# Altium project egse.PrjPcb (part 4 of 5)

## Sheet 5_3_frontend.SchDoc: RF Front-end module
size A4; OrganizationName: Pluton UPV; Address1: Universitat Politècnica; Address2: de València (UPV); Address3: Camí de Vera, València; Address4: Spain; SheetNumber: 9; SheetTotal: 12
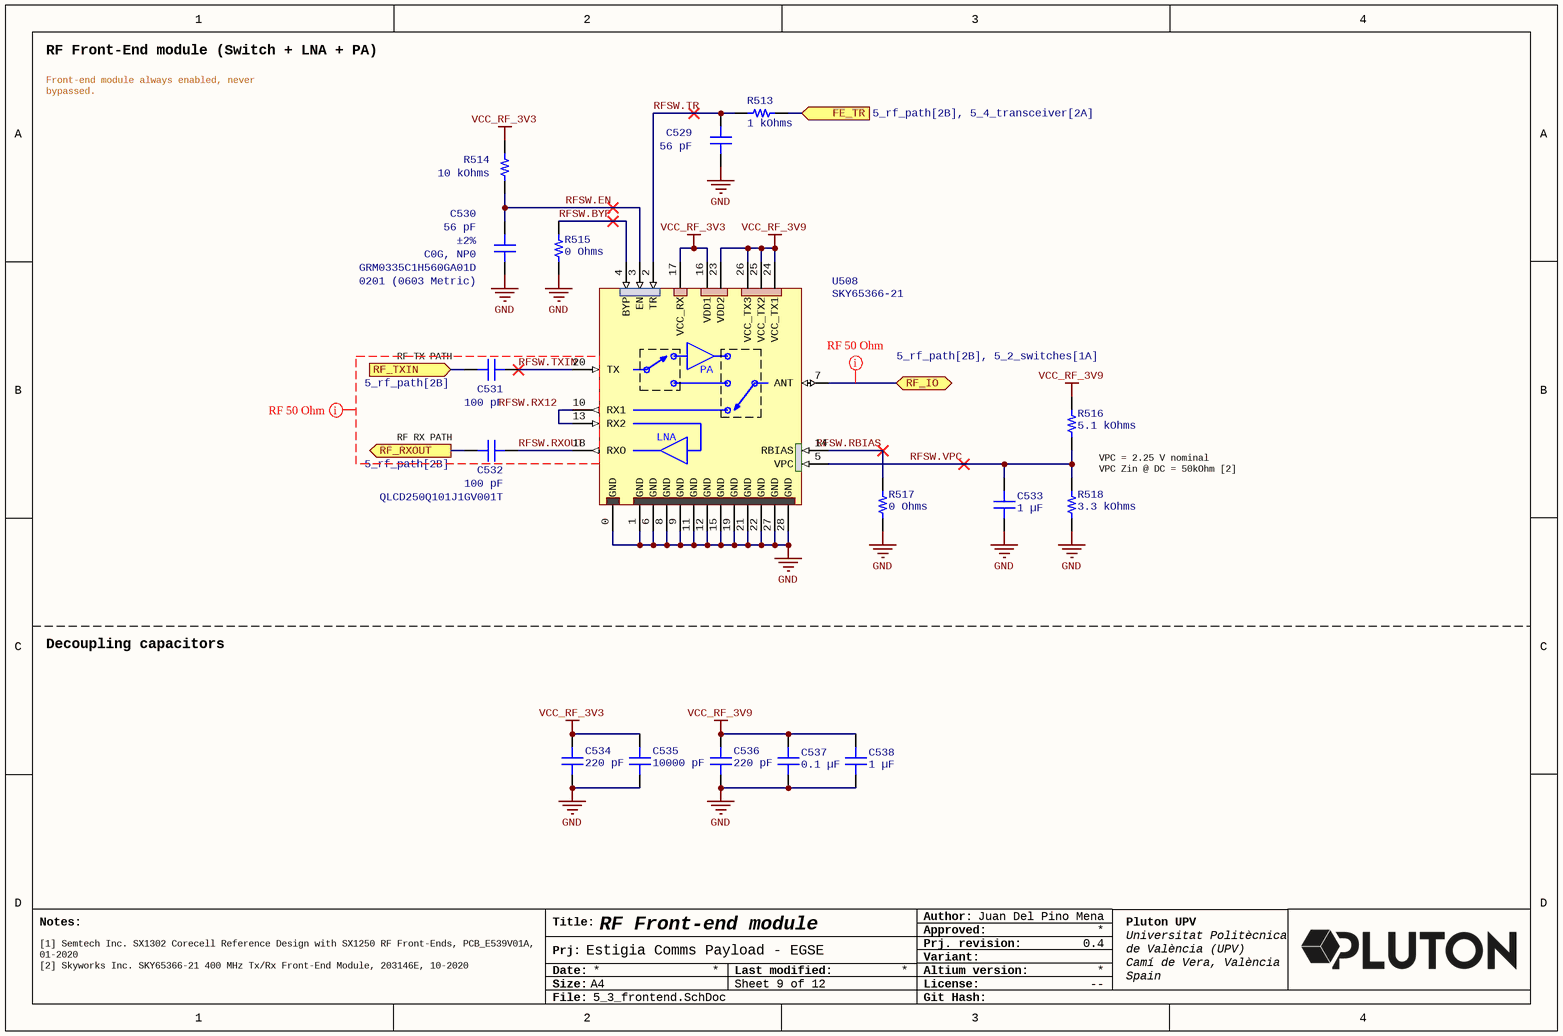
[diagram p7: 5_3_frontend.SchDoc]

### Parts
C529  56 pF  [CAP 0201_0603]
C530  Part Number: GRM0335C1H560GA01D  Package / Case: 0201 (0603 Metric)  Temperature Coefficient: C0G, NP0  Tolerance: ±2%  [CAP 0201_0603]  (hidden comment: 56 pF)
C531  Part Number: QLCD250Q101J1GV001T  [CAP 0201_0603 RF]  (hidden comment: 100 pF)
C532  100 pF  [CAP 0201_0603 RF]
C533  1 µF  [CAP 0402_1005]
C534  220 pF  [CAP 0201_0603]
C535  10000 pF  [CAP 0402_1005]
C536  220 pF  [CAP 0201_0603]
C537  0.1 µF  [CAP 0402_1005]
C538  1 µF  [CAP 0402_1005]
R513  1 kOhms  [RES 0201_0603]
R514  10 kOhms  [RES 0201_0603]
R515  0 Ohms  [RES 0201_0603]
R516  5.1 kOhms  [RES 0201_0603]
R517  0 Ohms  [RES 0201_0603]
R518  3.3 kOhms  [RES 0201_0603]
U508  SKY65366-21  [MCM-28-SKY65366-21]

### Ports
FE_TR (in, see 5_rf_path[2B], 5_4_transceiver[2A]), RF_IO (bidir, see 5_rf_path[2B], 5_2_switches[1A]), RF_RXOUT (out, see 5_rf_path[2B]), RF_TXIN (in, see 5_rf_path[2B])

### Nets
GND: C529.1 C530.1 C533.1 C534.1 C535.1 C536.1 C537.1 C538.1 R515.1 R517.1 R518.1 U508.0(GND) U508.1(GND) U508.6(GND) U508.8(GND) U508.9(GND) U508.11(GND) U508.12(GND) U508.15(GND) U508.19(GND) U508.21(GND) U508.22(GND) U508.27(GND) U508.28(GND)
VCC_RF_3V3: C534.2 C535.2 R514.2 U508.16(VDD1) U508.17(VCC_RX)
VCC_RF_3V9: C536.2 C537.2 C538.2 R516.2 U508.23(VDD2) U508.24(VCC_TX1) U508.25(VCC_TX2) U508.26(VCC_TX3)
FE_TR: R513.2 ; port FE_TR
RF_IO: U508.7(ANT) ; port RF_IO
RF_RXIN: C532.1 ; port RF_RXOUT
RF_TXIN: C531.1 ; port RF_TXIN
RFSW.BYP: R515.2 U508.4(BYP)  [project net RFSW.BYP_9]
RFSW.EN: C530.2 R514.1 U508.3(EN)  [project net RFSW.EN_9]
RFSW.RBIAS: R517.2 U508.14(RBIAS)  [project net RFSW.RBIAS_9]
RFSW.RX12: U508.10(RX1) U508.13(RX2)  [project net RFSW.RX12_9]
RFSW.RXOUT: C532.2 U508.18(RXO)  [project net RFSW.RXOUT_9]
RFSW.TR: C529.2 R513.1 U508.2(TR)  [project net RFSW.TR_9]
RFSW.TXIN: C531.2 U508.20(TX)  [project net RFSW.TXIN_9]
RFSW.VPC: C533.2 R516.1 R518.2 U508.5(VPC)  [project net RFSW.VPC_9]

### Layout directives
net class RF50; rule Width Constraint [Pref Impedance = 50.00ohms    Min Impedance = 50.00ohms    Max Impedance = 50.00ohms]: RF_IO, RFSW.RX12, RFSW.RXOUT, RFSW.TXIN

### Notes on the sheet
- Front-end module always enabled, never bypassed.
- RF Front-End module (Switch + LNA + PA)
- (near C531) RF TX PATH
- (near C532) RF RX PATH
- VPC = 2.25 V nominal
  VPC Zin @ DC = 50kOhm [2]
- Decoupling capacitors
- [1] Semtech Inc. SX1302 Corecell Reference Design with SX1250 RF Front-Ends, PCB_E539V01A, 01-2020
  [2] Skyworks Inc. SKY65366-21 400 MHz Tx/Rx Front-End Module, 203146E, 10-2020
- Notes:
- Title:
- Author:
- Approved:
- Date:
- Prj:
- Size:
- A4
- Last modified:
- Altium version:
- Variant:
- Prj. revision:
- License:
- --
- File:
- Git Hash:
- (in symbol SKY65366-21) PA; LNA

### Library data of the parts
C529 = GRM0335C1H560GA01D: CAP CER 56PF 50V C0G/NP0 0201; manufacturer: Murata Electronics; Temperature Coefficient: C0G, NP0; Tolerance: ±2%; Part Number: GRM0335C1H560GA01D; Value: 56 pF; Applications: General Purpose; Capacitance: 56 pF; componentlink1description: Datasheet; componentlink1url: https://search.murata.co.jp/Ceramy/image/img/A01X/G101/ENG/GRM0335C1H560GA01-01.pdf; componentlink2description: DigiKey Link; componentlink2url: https://www.digikey.com/en/products/detail/murata-electronics/GRM0335C1H560GA01D/4358755; Device Package: 0201 (0603 Metric); lastupdated: 04/06/2024 19:01:09; Lifecycle Status: Active; Minimum Order: 1; Mounting Type: Surface Mount; Operating Temperature: -55°C ~ 125°C; Package / Case: 0201 (0603 Metric); packaging: CutTape; partid: 528; Part Status: Active; price: 0.01; series: GRM; Size / Dimension: 0.024" L x 0.012" W (0.60mm x 0.30mm); Supplier 1: DigiKey; Supplier Part Number 1: 490-13329-1-ND; Thickness (Max): 0.013" (0.33mm); Voltage - Rated: 50V
C530 = GRM0335C1H560GA01D: CAP CER 56PF 50V C0G/NP0 0201; manufacturer: Murata Electronics; Value: 56 pF; Applications: General Purpose; Capacitance: 56 pF; componentlink1description: Datasheet; componentlink1url: https://search.murata.co.jp/Ceramy/image/img/A01X/G101/ENG/GRM0335C1H560GA01-01.pdf; componentlink2description: DigiKey Link; componentlink2url: https://www.digikey.com/en/products/detail/murata-electronics/GRM0335C1H560GA01D/4358755; Device Package: 0201 (0603 Metric); lastupdated: 04/06/2024 19:01:09; Lifecycle Status: Active; Minimum Order: 1; Mounting Type: Surface Mount; Operating Temperature: -55°C ~ 125°C; packaging: CutTape; partid: 528; Part Status: Active; price: 0.01; series: GRM; Size / Dimension: 0.024" L x 0.012" W (0.60mm x 0.30mm); Supplier 1: DigiKey; Supplier Part Number 1: 490-13329-1-ND; Thickness (Max): 0.013" (0.33mm); Voltage - Rated: 50V
C531 C532 = QLCD250Q101J1GV001T: CAP CER 100PF 25V C0G/NP0 0201; manufacturer: Johanson Technology Inc.; Temperature Coefficient: C0G, NP0; Tolerance: ±5%; Applications: RF, Microwave, High Frequency; Capacitance: 100 pF; componentlink1description: Datasheet; componentlink1url: https://www.johansontechnology.com/downloads/catalog/johanson-technology-multi-layer-high-q-capacitors.pdf; componentlink2description: DigiKey Link; componentlink2url: https://www.digikey.com/en/products/detail/johanson-technology-inc/QLCD250Q101J1GV001T/1561511; Device Package: 0201 (0603 Metric); Features: High Q, Low Loss; lastupdated: 03/06/2024 19:34:07; Lifecycle Status: Active; Minimum Order: 1; Mounting Type: Surface Mount, MLCC; Operating Temperature: -55°C ~ 125°C; Package / Case: 0201 (0603 Metric); packaging: TapeAndReel; partid: 3724; Part Status: Active; price: 0.02; series: L; Size / Dimension: 0.024" L x 0.012" W (0.60mm x 0.30mm); Supplier 1: DigiKey; Supplier Part Number 1: 712-QLCD250Q101J1GV001TCT-ND; Thickness (Max): 0.013" (0.33mm); value: 100 pF; Voltage - Rated: 25V
  C532: Part Number: QLCD250Q101J1GV001T
C533 = CL05A105KO5NNNC: CAP CER 1UF 16V X5R 0402; manufacturer: Samsung Electro-Mechanics; Tolerance: ±10%; Part Number: CL05A105KO5NNNC; Value: 1 µF; Applications: General Purpose; Capacitance: 1 µF; componentlink1description: Datasheet; componentlink1url: http://www.samsungsem.com/kr/support/product-search/mlcc/CL05A105KO5NNNC.jsp; componentlink2description: DigiKey Link; componentlink2url: https://www.digikey.com/en/products/detail/samsung-electro-mechanics/CL05A105KO5NNNC/3886725; Device Package: 0402 (1005 Metric); lastupdated: 09/02/2024 20:04:35; Lifecycle Status: Active; Minimum Order: 1; Mounting Type: Surface Mount, MLCC; Operating Temperature: -55°C ~ 85°C; Package / Case: 0402 (1005 Metric); packaging: TapeAndReel; partid: 3120; Part Status: Active; price: 0.01; series: CL; Size / Dimension: 0.039" L x 0.020" W (1.00mm x 0.50mm); Supplier 1: DigiKey; Supplier Part Number 1: 1276-1067-1-ND; Temperature Coefficient: X5R; Thickness (Max): 0.022" (0.55mm); Voltage - Rated: 16V
C534 C536 = GRM0335C1H221JA01D: CAP CER 220PF 50V C0G/NP0 0201; manufacturer: Murata Electronics; Temperature Coefficient: C0G, NP0; Tolerance: ±5%; Part Number: GRM0335C1H221JA01D; Value: 220 pF; Applications: General Purpose; Capacitance: 220 pF; componentlink1description: Datasheet; componentlink1url: https://search.murata.co.jp/Ceramy/image/img/A01X/G101/ENG/GRM0335C1H221JA01-01.pdf; componentlink2description: DigiKey Link; componentlink2url: https://www.digikey.com/en/products/detail/murata-electronics/GRM0335C1H221JA01D/4904370; Device Package: 0201 (0603 Metric); lastupdated: 04/06/2024 19:01:09; Lifecycle Status: Active; Minimum Order: 1; Mounting Type: Surface Mount; Operating Temperature: -55°C ~ 125°C; Package / Case: 0201 (0603 Metric); packaging: CutTape; partid: 574; Part Status: Active; price: 0.01; series: GRM; Size / Dimension: 0.024" L x 0.012" W (0.60mm x 0.30mm); Supplier 1: DigiKey; Supplier Part Number 1: 490-11316-1-ND; Thickness (Max): 0.013" (0.33mm); Voltage - Rated: 50V
C535 = GRM1555C1E103JE01J: CAP CER 10000PF 25V C0G/NP0 0402; manufacturer: Murata Electronics; Temperature Coefficient: C0G, NP0; Tolerance: ±5%; Part Number: GRM1555C1E103JE01J; Value: 10000 pF; Applications: General Purpose; Capacitance: 10000 pF; componentlink1description: Datasheet; componentlink1url: https://search.murata.co.jp/Ceramy/image/img/A01X/G101/ENG/GRM1555C1E103JE01-01A.pdf; componentlink2description: DigiKey Link; componentlink2url: https://www.digikey.com/en/products/detail/murata-electronics/GRM1555C1E103JE01J/16033801; Device Package: 0402 (1005 Metric); lastupdated: 09/02/2024 20:04:09; Lifecycle Status: Active; Minimum Order: 1; Mounting Type: Surface Mount, MLCC; Operating Temperature: -55°C ~ 125°C; Package / Case: 0402 (1005 Metric); packaging: TapeAndReel; partid: 41084; Part Status: Active; price: 0.02; series: GRM; Size / Dimension: 0.039" L x 0.020" W (1.00mm x 0.50mm); Supplier 1: DigiKey; Supplier Part Number 1: 490-GRM1555C1E103JE01JCT-ND; Thickness (Max): 0.026" (0.65mm); Voltage - Rated: 25V
C537 = C0402C104K4RECAUTO: CAP CER 0402 0.1UF 16V X7R 10%; manufacturer: KEMET; Part Number: C0402C104K4RECAUTO; Value: 0.1 µF; Applications: Automotive, ESD Protection; Capacitance: 0.1 µF; componentlink1description: Datasheet; componentlink1url: https://api.kemet.com/component-edge/download/datasheet/C0402C104K4RECAUTO.pdf; componentlink2description: DigiKey Link; componentlink2url: https://www.digikey.com/en/products/detail/kemet/C0402C104K4RECAUTO/8563695; Device Package: 0402 (1005 Metric); lastupdated: 09/02/2024 20:04:38; Lifecycle Status: Active; Minimum Order: 1; Mounting Type: Surface Mount, MLCC; Operating Temperature: -55°C ~ 125°C; Package / Case: 0402 (1005 Metric); packaging: TapeAndReel; partid: 1731; Part Status: Active; price: 0.01; Ratings: AEC-Q200; series: ESD SMD Auto X7R; Size / Dimension: 0.039" L x 0.020" W (1.00mm x 0.50mm); Supplier 1: DigiKey; Supplier Part Number 1: 399-17167-1-ND; Temperature Coefficient: X7R; Thickness (Max): 0.022" (0.55mm); Tolerance: ±10%; Voltage - Rated: 16V
C538 = GRT155C71A105KE13D: CAP CER 1UF 10V X7S 0402; manufacturer: Murata Electronics; Tolerance: ±10%; Part Number: GRT155C71A105KE13D; Value: 1 µF; Applications: Automotive; Capacitance: 1 µF; componentlink1description: Datasheet; componentlink1url: https://search.murata.co.jp/Ceramy/image/img/A01X/G101/ENG/GRT155C71A105KE13-01.pdf; componentlink2description: DigiKey Link; componentlink2url: https://www.digikey.com/en/products/detail/murata-electronics/GRT155C71A105KE13D/10695747; Device Package: 0402 (1005 Metric); lastupdated: 09/02/2024 20:04:05; Lifecycle Status: Active; Minimum Order: 1; Mounting Type: Surface Mount, MLCC; Operating Temperature: -55°C ~ 125°C; Package / Case: 0402 (1005 Metric); packaging: TapeAndReel; partid: 47127; Part Status: Active; price: 0.04; Ratings: AEC-Q200; series: GRT; Size / Dimension: 0.039" L x 0.020" W (1.00mm x 0.50mm); Supplier 1: DigiKey; Supplier Part Number 1: 490-GRT155C71A105KE13DCT-ND; Temperature Coefficient: X7S; Thickness (Max): 0.024" (0.60mm); Voltage - Rated: 10V
R513 = AC0201FR-071KL: RES SMD 1K OHM 1% 1/20W 0201; Manufacturer: Yageo; Power (Watts): 0.05W, 1/20W; Temperature Coefficient: ±200ppm/°C; Part Number: AC0201FR-071KL; Value: 1 kOhms; ComponentLink1Description: Datasheet; ComponentLink1URL: https://www.yageo.com/upload/media/product/productsearch/datasheet/rchip/PYu-AC_51_RoHS_L_7.pdf; ComponentLink2Description: DigiKey Link; ComponentLink2URL: https://www.digikey.com/en/products/detail/yageo/AC0201FR-071KL/5894376; Composition: Thick Film; Device Package: 0201 (0603 Metric); Features: Automotive AEC-Q200, Moisture Resistant; Height - Seated (Max): 0.010" (0.26mm); LastUpdated: 04/06/2024 19:11:52; Lifecycle Status: Active; Minimum Order: 1; Number of Terminations: 2; Operating Temperature: -55°C ~ 155°C; Package / Case: 0201 (0603 Metric); Packaging: TapeAndReel; PartId: 4299; Part Status: Active; Price: 0.01; Ratings: AEC-Q200; Resistance: 1 kOhms; Series: AC; Size / Dimension: 0.024" L x 0.012" W (0.60mm x 0.30mm); Supplier 1: DigiKey; Supplier Part Number 1: YAG3417CT-ND; Supplier Device Package: 0201; Tolerance: ±1%
R514 = AF0201FR-0710KL: RES SMD 10K OHM 1% 1/20W 0201; Manufacturer: Yageo; Power (Watts): 0.05W, 1/20W; Temperature Coefficient: ±200ppm/°C; Part Number: AF0201FR-0710KL; Value: 10 kOhms; ComponentLink1Description: Datasheet; ComponentLink1URL: https://www.yageo.com/upload/media/product/productsearch/datasheet/rchip/PYu-AF_51_RoHS_L_9.pdf; ComponentLink2Description: DigiKey Link; ComponentLink2URL: https://www.digikey.com/en/products/detail/yageo/AF0201FR-0710KL/5900138; Composition: Thick Film; Device Package: 0201 (0603 Metric); Features: Anti-Sulfur, Automotive AEC-Q200; Height - Seated (Max): 0.010" (0.26mm); LastUpdated: 04/06/2024 19:11:47; Lifecycle Status: Active; Minimum Order: 1; Number of Terminations: 2; Operating Temperature: -55°C ~ 125°C; Package / Case: 0201 (0603 Metric); Packaging: TapeAndReel; PartId: 78061; Part Status: Active; Price: 0.01; Ratings: AEC-Q200; Resistance: 10 kOhms; Series: AF; Size / Dimension: 0.024" L x 0.012" W (0.60mm x 0.30mm); Supplier 1: DigiKey; Supplier Part Number 1: 13-AF0201FR-0710KLCT-ND; Supplier Device Package: 0201; Tolerance: ±1%
R515 R517 = AC0201JR-070RL: RES SMD 0 OHM JUMPER 1/20W 0201; Manufacturer: Yageo; Power (Watts): 0.05W, 1/20W; Part Number: AC0201JR-070RL; Value: 0 Ohms; ComponentLink1Description: Datasheet; ComponentLink1URL: https://www.yageo.com/upload/media/product/productsearch/datasheet/rchip/PYu-AC_51_RoHS_L_7.pdf; ComponentLink2Description: DigiKey Link; ComponentLink2URL: https://www.digikey.com/en/products/detail/yageo/AC0201JR-070RL/5894880; Composition: Thick Film; Device Package: 0201 (0603 Metric); Features: Automotive AEC-Q200, Moisture Resistant; Height - Seated (Max): 0.010" (0.26mm); LastUpdated: 04/06/2024 19:12:00; Lifecycle Status: Active; Minimum Order: 1; Number of Terminations: 2; Operating Temperature: -55°C ~ 155°C; Package / Case: 0201 (0603 Metric); Packaging: CutTape; PartId: 818; Part Status: Active; Price: 0.01; Ratings: AEC-Q200; Resistance: 0 Ohms; Series: AC; Size / Dimension: 0.024" L x 0.012" W (0.60mm x 0.30mm); Supplier 1: DigiKey; Supplier Part Number 1: YAG3427CT-ND; Supplier Device Package: 0201; Tolerance: Jumper
R516 = ERJ-1GNF5101C: RES SMD 5.1K OHM 1% 1/20W 0201; Manufacturer: Panasonic Electronic Components; Power (Watts): 0.05W, 1/20W; Temperature Coefficient: ±200ppm/°C; Part Number: ERJ-1GNF5101C; Value: 5.1 kOhms; ComponentLink1Description: Datasheet; ComponentLink1URL: https://industrial.panasonic.com/cdbs/www-data/pdf/RDA0000/AOA0000C304.pdf; ComponentLink2Description: DigiKey Link; ComponentLink2URL: https://www.digikey.com/en/products/detail/panasonic-electronic-components/ERJ-1GNF5101C/2036192; Composition: Thick Film; Device Package: 0201 (0603 Metric); Features: Automotive AEC-Q200; Height - Seated (Max): 0.010" (0.26mm); LastUpdated: 04/06/2024 19:11:52; Lifecycle Status: Active; Minimum Order: 1; Number of Terminations: 2; Operating Temperature: -55°C ~ 125°C; Package / Case: 0201 (0603 Metric); Packaging: TapeAndReel; PartId: 4177; Part Status: Active; Price: 0.01; Ratings: AEC-Q200; Resistance: 5.1 kOhms; Series: ERJ-1GN; Size / Dimension: 0.024" L x 0.012" W (0.60mm x 0.30mm); Supplier 1: DigiKey; Supplier Part Number 1: P123051CT-ND; Supplier Device Package: 0201; Tolerance: ±1%
R518 = ERJ-1GJF3301C: RES SMD 3.3K OHM 1% 1/20W 0201; Manufacturer: Panasonic Electronic Components; Power (Watts): 0.05W, 1/20W; Temperature Coefficient: ±200ppm/°C; Part Number: ERJ-1GJF3301C; Value: 3.3 kOhms; ComponentLink1Description: Datasheet; ComponentLink1URL: https://api.pim.na.industrial.panasonic.com/file_stream/main/fileversion/1263; ComponentLink2Description: DigiKey Link; ComponentLink2URL: https://www.digikey.com/en/products/detail/panasonic-electronic-components/ERJ-1GJF3301C/19101344; Composition: Thick Film; Device Package: 0201 (0603 Metric); Features: Automotive AEC-Q200; Height - Seated (Max): 0.010" (0.26mm); LastUpdated: 04/06/2024 19:11:47; Lifecycle Status: Active; Minimum Order: 1; Number of Terminations: 2; Operating Temperature: -55°C ~ 125°C; Package / Case: 0201 (0603 Metric); Packaging: TapeAndReel; PartId: 80200; Price: 0.02; Ratings: AEC-Q200; Resistance: 3.3 kOhms; Series: ERJ-1GJ; Size / Dimension: 0.024" L x 0.012" W (0.60mm x 0.30mm); Supplier 1: DigiKey; Supplier Part Number 1: 10-ERJ-1GJF3301CCT-ND; Supplier Device Package: 0201; Tolerance: ±1%
U508 = SKY65366-21: 400 MHz Transmit/Receive Front-End Module

## Sheet 5_1_attenuators.SchDoc: RF Attenuators
size A4; OrganizationName: Pluton UPV; Address1: Universitat Politècnica; Address2: de València (UPV); Address3: Camí de Vera, València; Address4: Spain; SheetNumber: 7; SheetTotal: 12
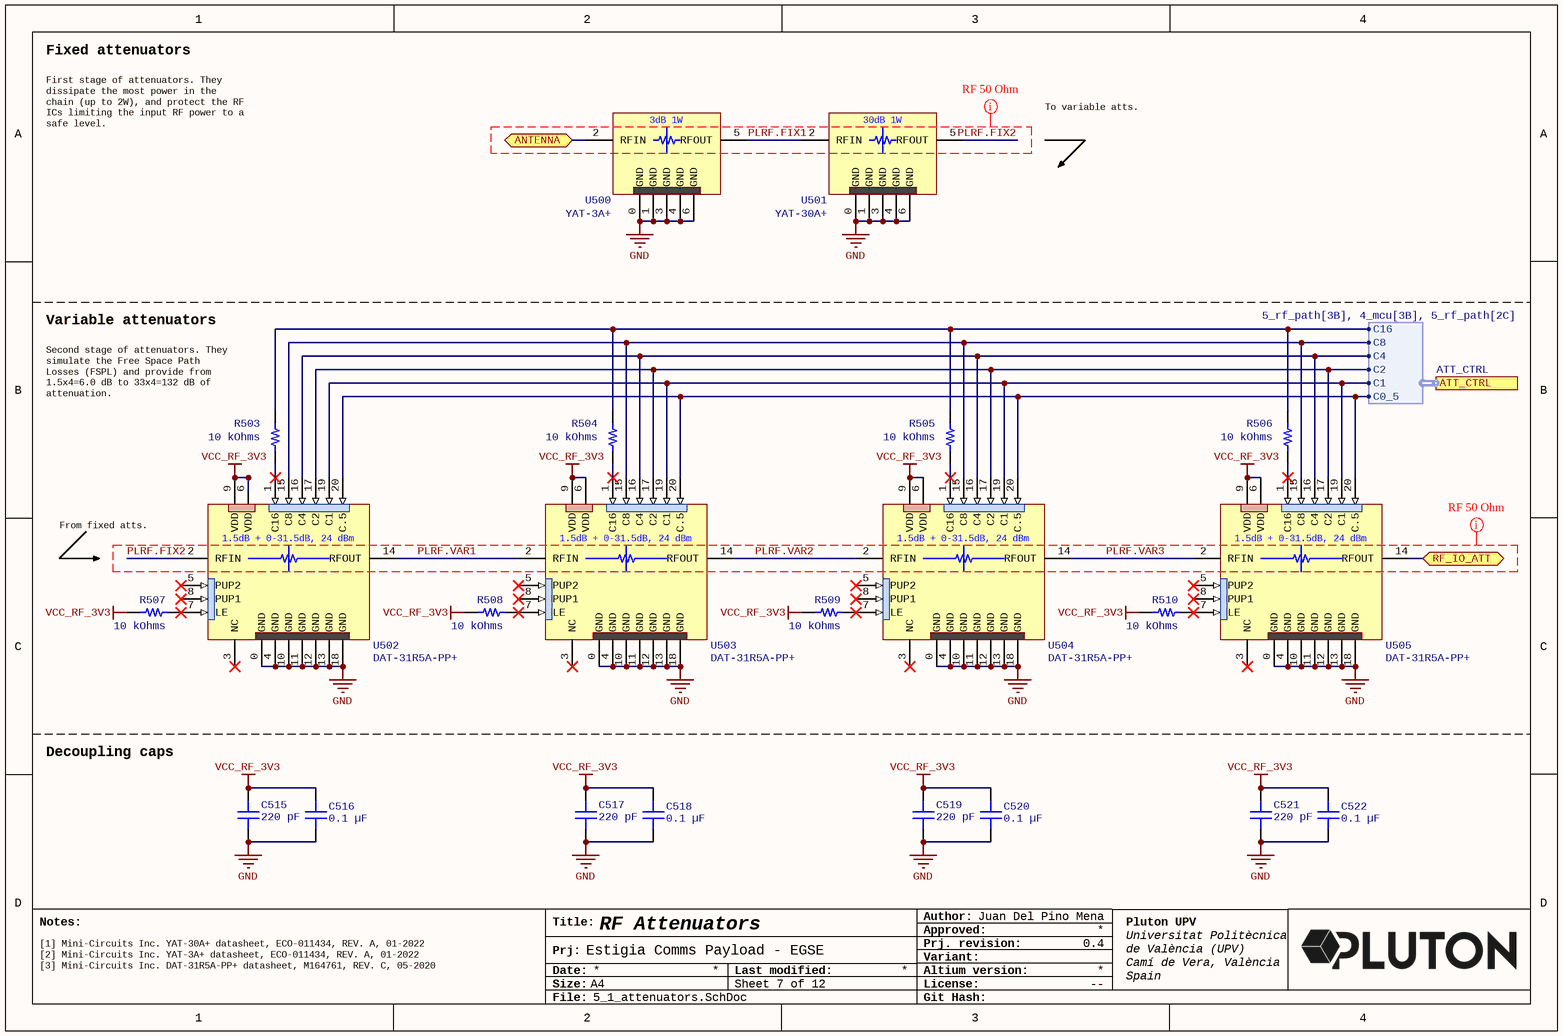
[diagram p8: 5_1_attenuators.SchDoc]

### Parts
C515  220 pF  [CAP 0201_0603]
C516  0.1 µF  [CAP 0402_1005]
C517  220 pF  [CAP 0201_0603]
C518  0.1 µF  [CAP 0402_1005]
C519  220 pF  [CAP 0201_0603]
C520  0.1 µF  [CAP 0402_1005]
C521  220 pF  [CAP 0201_0603]
C522  0.1 µF  [CAP 0402_1005]
R503  10 kOhms  [RES 0201_0603]
R504  10 kOhms  [RES 0201_0603]
R505  10 kOhms  [RES 0201_0603]
R506  10 kOhms  [RES 0201_0603]
R507  10 kOhms  [RES 0201_0603]
R508  10 kOhms  [RES 0201_0603]
R509  10 kOhms  [RES 0201_0603]
R510  10 kOhms  [RES 0201_0603]
U500  YAT-3A+  [MC1630]
U501  YAT-30A+  [MC1630]
U502  DAT-31R5A-PP+  [DG983-2]
U503  DAT-31R5A-PP+  [DG983-2]
U504  DAT-31R5A-PP+  [DG983-2]
U505  DAT-31R5A-PP+  [DG983-2]

### Ports
ANTENNA (bidir, see 5_rf_path[3B]), ATT_CTRL (harness ATT_CTRL, see 5_rf_path[3B], 4_mcu[3B], 5_rf_path[2C]), RF_IO_ATT (bidir, see 5_rf_path[3B], 5_2_switches[3B])

### Harnesses
ATT_CTRL: C16, C8, C4, C2, C1, C0_5

### Nets
GND: C515.1 C516.1 C517.1 C518.1 C519.1 C520.1 C521.1 C522.1 U500.0(GND) U500.1(GND) U500.3(GND) U500.4(GND) U500.6(GND) U501.0(GND) U501.1(GND) U501.3(GND) U501.4(GND) U501.6(GND) U502.0(GND) U502.4(GND) U502.10(GND) U502.11(GND) U502.12(GND) U502.13(GND) U502.18(GND) U503.0(GND) U503.4(GND) U503.10(GND) U503.11(GND) U503.12(GND) U503.13(GND) U503.18(GND) U504.0(GND) U504.4(GND) U504.10(GND) U504.11(GND) U504.12(GND) U504.13(GND) U504.18(GND) U505.0(GND) U505.4(GND) U505.10(GND) U505.11(GND) U505.12(GND) U505.13(GND) U505.18(GND)
VCC_RF_3V3: C515.2 C516.2 C517.2 C518.2 C519.2 C520.2 C521.2 C522.2 R507.2 R508.2 R509.2 R510.2 U502.6(VDD) U502.9(VDD) U503.6(VDD) U503.9(VDD) U504.6(VDD) U504.9(VDD) U505.6(VDD) U505.9(VDD)
ANTENNA: U500.2(RFIN) ; port ANTENNA
ATT_CTRL.C0_5: U502.20(C.5) U503.20(C.5) U504.20(C.5) U505.20(C.5) ; port ATT_CTRL.C0_5
ATT_CTRL.C1: U502.19(C1) U503.19(C1) U504.19(C1) U505.19(C1) ; port ATT_CTRL.C1
ATT_CTRL.C2: U502.17(C2) U503.17(C2) U504.17(C2) U505.17(C2) ; port ATT_CTRL.C2
ATT_CTRL.C4: U502.16(C4) U503.16(C4) U504.16(C4) U505.16(C4) ; port ATT_CTRL.C4
ATT_CTRL.C8: U502.15(C8) U503.15(C8) U504.15(C8) U505.15(C8) ; port ATT_CTRL.C8
ATT_CTRL.C16: R503.1 R504.1 R505.1 R506.1 ; port ATT_CTRL.C16
PLRF.FIX1: U500.5(RFOUT) U501.2(RFIN)  [project net PLRF.FIX1_7]
PLRF.FIX2: U501.5(RFOUT) U502.2(RFIN)  [project net PLRF.FIX2_7]
PLRF.VAR1: U502.14(RFOUT) U503.2(RFIN)  [project net PLRF.VAR1_7]
PLRF.VAR2: U503.14(RFOUT) U504.2(RFIN)  [project net PLRF.VAR2_7]
PLRF.VAR3: U504.14(RFOUT) U505.2(RFIN)  [project net PLRF.VAR3_7]
RF_IO_ATT: U505.14(RFOUT) ; port RF_IO_ATT
NetR503_2: R503.2 U502.1(C16)
NetR504_2: R504.2 U503.1(C16)
NetR505_2: R505.2 U504.1(C16)
NetR506_2: R506.2 U505.1(C16)
NetR507_1: R507.1 U502.7(LE)
NetR508_1: R508.1 U503.7(LE)
NetR509_1: R509.1 U504.7(LE)
NetR510_1: R510.1 U505.7(LE)

Not connected (* = marked no-connect by the designer): U502 3(NC)* 5(PUP2)* 8(PUP1)*; U503 3(NC)* 5(PUP2)* 8(PUP1)*; U504 3(NC)* 5(PUP2)* 8(PUP1)*; U505 3(NC)* 5(PUP2)* 8(PUP1)*

### Layout directives
net class RF50; rule Width Constraint [Pref Impedance = 50.00ohms    Min Impedance = 50.00ohms    Max Impedance = 50.00ohms]: PLRF.FIX1, PLRF.FIX2, PLRF.VAR1, PLRF.VAR2, PLRF.VAR3

### Notes on the sheet
- Fixed attenuators
- To variable atts.
- First stage of attenuators. They dissipate the most power in the chain (up to 2W), and protect the RF ICs limiting the input RF power to a safe level.
- Variable attenuators
- (near R503) Second stage of attenuators. They simulate the Free Space Path Losses (FSPL) and provide from 1.5x4=6.0 dB to 33x4=132 dB of attenuation.
- (near U502) From fixed atts.
- Decoupling caps
- [1] Mini-Circuits Inc. YAT-30A+ datasheet, ECO-011434, REV. A, 01-2022
  [2] Mini-Circuits Inc. YAT-3A+ datasheet, ECO-011434, REV. A, 01-2022
  [3] Mini-Circuits Inc. DAT-31R5A-PP+ datasheet, M164761, REV. C, 05-2020
- Notes:
- Title:
- Author:
- Approved:
- Date:
- Prj:
- Size:
- A4
- Last modified:
- Altium version:
- Variant:
- Prj. revision:
- License:
- --
- File:
- Git Hash:
- (in symbol DAT-31R5A-PP+) 1.5dB + 0-31.5dB, 24 dBm
- (in symbol YAT-3A) 3dB 1W
- (in symbol YAT-30A) 30dB 1W

### Library data of the parts
C515 C517 C519 C521 = GRM0335C1H221JA01D: as C534 on sheet 5_3_frontend; Part Number: GRM0335C1H221JA01D; Value: 220 pF; Applications: General Purpose; Capacitance: 220 pF; componentlink1description: Datasheet; componentlink1url: https://search.murata.co.jp/Ceramy/image/img/A01X/G101/ENG/GRM0335C1H221JA01-01.pdf; componentlink2description: DigiKey Link; componentlink2url: https://www.digikey.com/en/products/detail/murata-electronics/GRM0335C1H221JA01D/4904370; Device Package: 0201 (0603 Metric); lastupdated: 04/06/2024 19:01:09; Lifecycle Status: Active; Minimum Order: 1; Mounting Type: Surface Mount; Operating Temperature: -55°C ~ 125°C; Package / Case: 0201 (0603 Metric); packaging: CutTape; partid: 574; Part Status: Active; price: 0.01; series: GRM; Size / Dimension: 0.024" L x 0.012" W (0.60mm x 0.30mm); Supplier 1: DigiKey; Supplier Part Number 1: 490-11316-1-ND; Thickness (Max): 0.013" (0.33mm); Voltage - Rated: 50V
C516 C518 C520 C522 = C0402C104K4RECAUTO: as C537 on sheet 5_3_frontend; Part Number: C0402C104K4RECAUTO; Value: 0.1 µF; Applications: Automotive, ESD Protection; Capacitance: 0.1 µF; componentlink1description: Datasheet; componentlink1url: https://api.kemet.com/component-edge/download/datasheet/C0402C104K4RECAUTO.pdf; componentlink2description: DigiKey Link; componentlink2url: https://www.digikey.com/en/products/detail/kemet/C0402C104K4RECAUTO/8563695; Device Package: 0402 (1005 Metric); lastupdated: 09/02/2024 20:04:38; Lifecycle Status: Active; Minimum Order: 1; Mounting Type: Surface Mount, MLCC; Operating Temperature: -55°C ~ 125°C; Package / Case: 0402 (1005 Metric); packaging: TapeAndReel; partid: 1731; Part Status: Active; price: 0.01; Ratings: AEC-Q200; series: ESD SMD Auto X7R; Size / Dimension: 0.039" L x 0.020" W (1.00mm x 0.50mm); Supplier 1: DigiKey; Supplier Part Number 1: 399-17167-1-ND; Temperature Coefficient: X7R; Thickness (Max): 0.022" (0.55mm); Tolerance: ±10%; Voltage - Rated: 16V
R503-R510 = AF0201FR-0710KL: as R514 on sheet 5_3_frontend; Part Number: AF0201FR-0710KL; Value: 10 kOhms; ComponentLink1Description: Datasheet; ComponentLink1URL: https://www.yageo.com/upload/media/product/productsearch/datasheet/rchip/PYu-AF_51_RoHS_L_9.pdf; ComponentLink2Description: DigiKey Link; ComponentLink2URL: https://www.digikey.com/en/products/detail/yageo/AF0201FR-0710KL/5900138; Composition: Thick Film; Device Package: 0201 (0603 Metric); Features: Anti-Sulfur, Automotive AEC-Q200; Height - Seated (Max): 0.010" (0.26mm); LastUpdated: 04/06/2024 19:11:47; Lifecycle Status: Active; Minimum Order: 1; Number of Terminations: 2; Operating Temperature: -55°C ~ 125°C; Package / Case: 0201 (0603 Metric); Packaging: TapeAndReel; PartId: 78061; Part Status: Active; Price: 0.01; Ratings: AEC-Q200; Resistance: 10 kOhms; Series: AF; Size / Dimension: 0.024" L x 0.012" W (0.60mm x 0.30mm); Supplier 1: DigiKey; Supplier Part Number 1: 13-AF0201FR-0710KLCT-ND; Supplier Device Package: 0201; Tolerance: ±1%
U500 = YAT-3A: Fixed Attenuator 50 OHM 2W 3 dB DC to 18 GHz
U501 = YAT-30A: Fixed Attenuator 50 OHM 1W 30 dB DC to 18 GHz
U502-U505 = DAT-31R5A-PP+: Digital Step Attenuator  50Ω 0 to 31.5 dB, 0.5 dB Step DC to 4.0 GHz parallel

## Sheet 5_4_transceiver.SchDoc: LoRa node transceiver
size A4; OrganizationName: Pluton UPV; Address1: Universitat Politècnica; Address2: de València (UPV); Address3: Camí de Vera, València; Address4: Spain; SheetNumber: 10; SheetTotal: 12
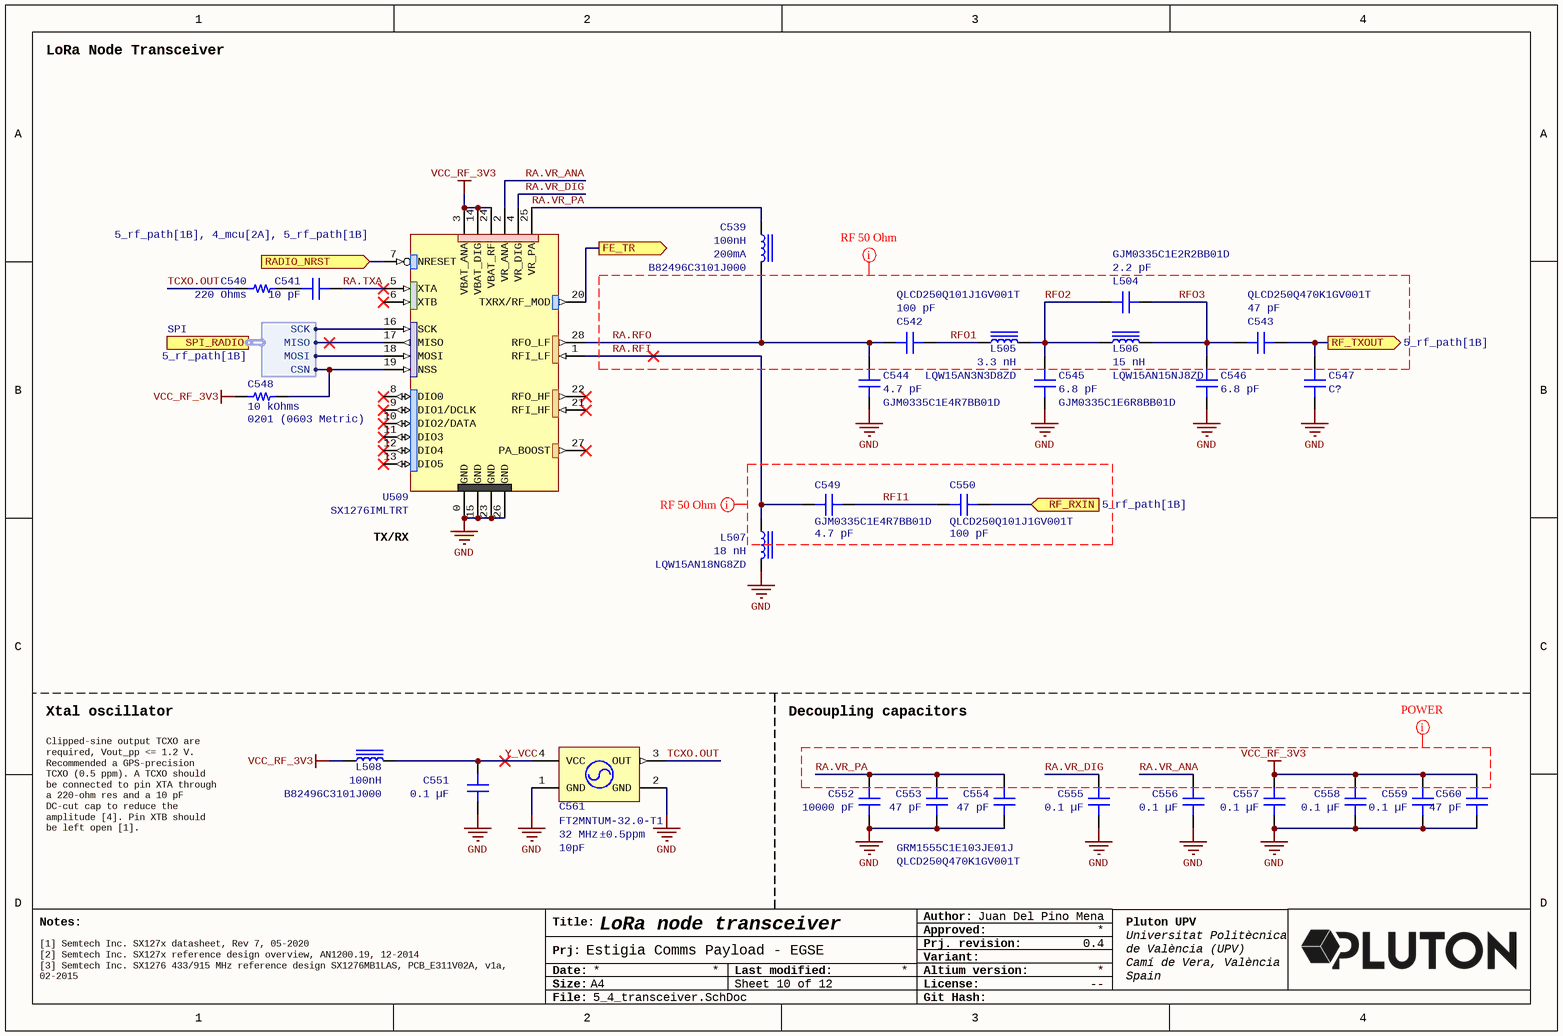
[diagram p9: 5_4_transceiver.SchDoc]

### Parts
C539  100nH  Part Number: B82496C3101J000  Current Rating (Amps): 200mA  [IND 0603_1608 RF WW]
C540  220 Ohms  [RES 0201_0603]
C541  10 pF  [CAP 0201_0603]
C542  Part Number: QLCD250Q101J1GV001T  [CAP 0201_0603 RF]  (hidden comment: 100 pF)
C543  Part Number: QLCD250Q470K1GV001T  [CAP 0201_0603 RF]  (hidden comment: 47 pF)
C544  Part Number: GJM0335C1E4R7BB01D  [CAP 0201_0603 RF]  (hidden comment: 4.7 pF)
C545  Part Number: GJM0335C1E6R8BB01D  [CAP 0201_0603 RF]  (hidden comment: 6.8 pF)
C546  6.8 pF  [CAP 0201_0603 RF]
C547  C?  [CAP 0201_0603]
C548  Package / Case: 0201 (0603 Metric)  [RES 0201_0603]  (hidden comment: 10 kOhms)
C549  Part Number: GJM0335C1E4R7BB01D  [CAP 0201_0603 RF]  (hidden comment: 4.7 pF)
C550  Part Number: QLCD250Q101J1GV001T  [CAP 0201_0603 RF]  (hidden comment: 100 pF)
C551  0.1 µF  [CAP 0402_1005]
C552  Part Number: GRM1555C1E103JE01J  [CAP 0402_1005]  (hidden comment: 10000 pF)
C553  47 pF  [CAP 0201_0603 RF]
C554  Part Number: QLCD250Q470K1GV001T  [CAP 0201_0603 RF]  (hidden comment: 47 pF)
C555  0.1 µF  [CAP 0402_1005]
C556  0.1 µF  [CAP 0402_1005]
C557  0.1 µF  [CAP 0402_1005]
C558  0.1 µF  [CAP 0402_1005]
C559  0.1 µF  [CAP 0402_1005]
C560  47 pF  [CAP 0201_0603 RF]
C561  Frequency: 32 MHz  Tolerance: ±0.5ppm  Load Capacitance: 10pF  [TCXO-XTAL-FT2MN]  (hidden comment: FT2MNTUM-32.0-T1)
L504  Part Number: GJM0335C1E2R2BB01D  [CAP 0201_0603]  (hidden comment: 2.2 pF)
L505  Part Number: LQW15AN3N3D8ZD  [IND 0402_1005 RF WW]  (hidden comment: 3.3 nH)
L506  Part Number: LQW15AN15NJ8ZD  [IND 0402_1005 RF WW]  (hidden comment: 15 nH)
L507  Part Number: LQW15AN18NG8ZD  [IND 0402_1005 RF WW]  (hidden comment: 18 nH)
L508  100nH  Part Number: B82496C3101J000  [IND 0603_1608 RF WW]
U509  SX1276IMLTRT  [QFN-28]

### Ports
FE_TR (out, see 5_rf_path[1B], 5_3_frontend[3A]), RADIO_NRST (in, see 5_rf_path[1B], 4_mcu[2A], 5_rf_path[1B]), RF_RXIN (in, see 5_rf_path[1B]), RF_TXOUT (out, see 5_rf_path[1B]), SPI_RADIO (harness SPI, see 5_rf_path[1B])

### Harnesses
SPI: CSN, MOSI, SCK, MISO

### Nets
GND: C544.1 C545.1 C546.1 C547.1 C551.1 C552.1 C553.1 C554.2 C555.1 C556.1 C557.1 C558.1 C559.1 C560.1 C561.1(GND) C561.2(GND) L507.2 U509.0(GND) U509.15(GND) U509.23(GND) U509.26(GND)
VCC_RF_3V3: C548.1 C557.2 C558.2 C559.2 C560.2 L508.1 U509.3(VBAT_ANA) U509.14(VBAT_DIG) U509.24(VBAT_RF)
FE_TR: U509.20(TXRX/RF_MOD) ; port FE_TR
RA.RFI: C549.2 L507.1 U509.1(RFI_LF)  [project net RA.RFI_10]
RA.RFO: C539.2 C542.1 C544.2 U509.28(RFO_LF)  [project net RA.RFO_10]
RA.TXA: C541.1 U509.5(XTA)  [project net RA.TXA_10]
RA.VR_ANA: C556.2 U509.2(VR_ANA)  [project net RA.VR_ANA_10]
RA.VR_DIG: C555.2 U509.4(VR_DIG)  [project net RA.VR_DIG_10]
RA.VR_PA: C539.1 C552.2 C553.2 C554.1 U509.25(VR_PA)  [project net RA.VR_PA_10]
RADIO_NRST: U509.7(NRESET) ; port RADIO_NRST
RF_RXIN: C550.1 ; port RF_RXIN
RF_TXIN: C543.2 C547.2 ; port RF_TXOUT
RFI1: C549.1 C550.2  [project net RFI1_10]
RFO1: C542.2 L505.1  [project net RFO1_10]
RFO2: C545.2 L504.1 L505.2 L506.1  [project net RFO2_10]
RFO3: C543.1 C546.2 L504.2 L506.2  [project net RFO3_10]
TCXO.OUT: C540.1 C561.3(OUT)  [project net TCXO.OUT_10]
Y_VCC: C551.2 C561.4(VCC) L508.2  [project net Y_VCC_10]
NetC540_2: C540.2 C541.2
NetC548_2: C548.2 U509.19(NSS) ; port SPI_RADIO.CSN
NetU400_21: U509.16(SCK) ; port SPI_RADIO.SCK
NetU400_22: U509.17(MISO) ; port SPI_RADIO.MISO
NetU400_23: U509.18(MOSI) ; port SPI_RADIO.MOSI

Not connected (* = marked no-connect by the designer): U509 6(XTB)* 8(DIO0)* 9(DIO1/DCLK)* 10(DIO2/DATA)* 11(DIO3)* 12(DIO4)* 13(DIO5)* 21(RFI_HF)* 22(RFO_HF)* 27(PA_BOOST)*

### Layout directives
rule Width Constraint [Pref Width = 0.4mm    Min Width = 0.3mm    Max Width = 0.5mm]; net class POWER: RA.VR_ANA, RA.VR_DIG, RA.VR_PA, VCC_RF_3V3
net class RF50; rule Width Constraint [Pref Impedance = 50.00ohms    Min Impedance = 50.00ohms    Max Impedance = 50.00ohms]: RA.RFI, RA.RFO, RFI1, RFO1, RFO2, RFO3

### Notes on the sheet
- LoRa Node Transceiver
- (near U509) TX/RX
- Xtal oscillator
- Decoupling capacitors
- Clipped-sine output TCXO are required, Vout_pp <= 1.2 V. Recommended a GPS-precision TCXO (0.5 ppm). A TCXO should be connected to pin XTA through a 220-ohm res and a 10 pF DC-cut cap to reduce the amplitude [4]. Pin XTB should be left open [1].
- [1] Semtech Inc. SX127x datasheet, Rev 7, 05-2020
  [2] Semtech Inc. SX127x reference design overview, AN1200.19, 12-2014
  [3] Semtech Inc. SX1276 433/915 MHz reference design SX1276MB1LAS, PCB_E311V02A, v1a, 02-2015
- Notes:
- Title:
- Author:
- Approved:
- Date:
- Prj:
- Size:
- A4
- Last modified:
- Altium version:
- Variant:
- Prj. revision:
- License:
- --
- File:
- Git Hash:

### Library data of the parts
C539 L508 = B82496C3101J000: FIXED IND 100NH 200MA 1.8 OHM; Manufacturer: TDK Electronics Inc.; DC Resistance (DCR): 1.8Ohm Max; Frequency - Self Resonant: 1.8GHz; Inductance Frequency - Test: 100MHz; Material - Core: Ceramic; Q @ Freq: 14 @ 100MHz; Shielding: Unshielded; Tolerance: ±5%; Type: Wirewound; ComponentLink1Description: Datasheet; ComponentLink1URL: https://www.tdk-electronics.tdk.com/inf/30/db/ind_2008/b82496c.pdf; ComponentLink2Description: DigiKey Link; ComponentLink2URL: http://digikey.com/product-detail/en/tdk-electronics-inc/B82496C3101J000/495-1825-1-ND/697680; Device Package: 0603 (1608 Metric); Inductance: 100nH; LastUpdated: 06/09/2020 11:05:16; Lifecycle Status: Active; Minimum Order: 1; Mounting Type: Surface Mount; Operating Temperature: -55°C ~ 150°C; Package / Case: 0603 (1608 Metric); Packaging: TapeAndReel; PartId: 755; Part Status: Active; Price: 0.16; Ratings: AEC-Q200; Series: SIMID; Supplier 1: DigiKey; Supplier Part Number 1: 495-1825-1-ND; Supplier Device Package: 0603 (1608 Metric); Value: 100nH
  L508: Current Rating (Amps): 200mA
C540 = RC0201FR-07220RL: RES 220 OHM 1% 1/20W 0201; Manufacturer: Yageo; Power (Watts): 0.05W, 1/20W; Temperature Coefficient: ±200ppm/°C; Part Number: RC0201FR-07220RL; Value: 220 Ohms; ComponentLink1Description: Datasheet; ComponentLink1URL: https://www.yageo.com/upload/media/product/productsearch/datasheet/rchip/PYu-RC_Group_51_RoHS_L_10.pdf; ComponentLink2Description: DigiKey Link; ComponentLink2URL: https://www.digikey.com/en/products/detail/yageo/RC0201FR-07220RL/5280369; Composition: Thick Film; Device Package: 0201 (0603 Metric); Features: Moisture Resistant; Height - Seated (Max): 0.010" (0.26mm); LastUpdated: 04/06/2024 19:12:00; Lifecycle Status: Active; Minimum Order: 1; Number of Terminations: 2; Operating Temperature: -55°C ~ 125°C; Package / Case: 0201 (0603 Metric); Packaging: TapeAndReel; PartId: 816; Part Status: Active; Price: 0.01; Resistance: 220 Ohms; Series: RC_L; Size / Dimension: 0.024" L x 0.012" W (0.60mm x 0.30mm); Supplier 1: DigiKey; Supplier Part Number 1: YAG2509CT-ND; Supplier Device Package: 0201; Tolerance: ±1%
C541 = GJM0335C1E100GB01D: CAP CER 10PF 25V C0G/NP0 0201; manufacturer: Murata Electronics; Temperature Coefficient: C0G, NP0; Tolerance: ±2%; Part Number: GJM0335C1E100GB01D; Value: 10 pF; Applications: RF, Microwave, High Frequency; Capacitance: 10 pF; componentlink1description: Datasheet; componentlink1url: https://search.murata.co.jp/Ceramy/image/img/A01X/G101/ENG/GJM0335C1E100GB01-01.pdf; componentlink2description: DigiKey Link; componentlink2url: https://www.digikey.com/en/products/detail/murata-electronics/GJM0335C1E100GB01D/7363126; Device Package: 0201 (0603 Metric); Features: High Q, Low Loss; lastupdated: 04/06/2024 19:01:11; Lifecycle Status: Active; Minimum Order: 1; Mounting Type: Surface Mount, MLCC; Operating Temperature: -55°C ~ 125°C; Package / Case: 0201 (0603 Metric); packaging: TapeAndReel; partid: 213; Part Status: Active; price: 0.01; series: GJM; Size / Dimension: 0.024" L x 0.012" W (0.60mm x 0.30mm); Supplier 1: DigiKey; Supplier Part Number 1: 490-16382-1-ND; Thickness (Max): 0.013" (0.33mm); Voltage - Rated: 25V
C542 C550 = QLCD250Q101J1GV001T: as C531 on sheet 5_3_frontend; Applications: RF, Microwave, High Frequency; Capacitance: 100 pF; componentlink1description: Datasheet; componentlink1url: https://www.johansontechnology.com/downloads/catalog/johanson-technology-multi-layer-high-q-capacitors.pdf; componentlink2description: DigiKey Link; componentlink2url: https://www.digikey.com/en/products/detail/johanson-technology-inc/QLCD250Q101J1GV001T/1561511; Device Package: 0201 (0603 Metric); Features: High Q, Low Loss; lastupdated: 03/06/2024 19:34:07; Lifecycle Status: Active; Minimum Order: 1; Mounting Type: Surface Mount, MLCC; Operating Temperature: -55°C ~ 125°C; Package / Case: 0201 (0603 Metric); packaging: TapeAndReel; partid: 3724; Part Status: Active; price: 0.02; series: L; Size / Dimension: 0.024" L x 0.012" W (0.60mm x 0.30mm); Supplier 1: DigiKey; Supplier Part Number 1: 712-QLCD250Q101J1GV001TCT-ND; Thickness (Max): 0.013" (0.33mm); value: 100 pF; Voltage - Rated: 25V
C543 C553 C554 C560 = QLCD250Q470K1GV001T: CAP CER 47PF 25V NP0 0201; manufacturer: Johanson Technology Inc.; Temperature Coefficient: C0G, NP0; Tolerance: ±10%; Applications: RF, Microwave, High Frequency; Capacitance: 47 pF; componentlink1description: Datasheet; componentlink1url: https://www.johansontechnology.com/downloads/catalog/johanson-technology-multi-layer-high-q-capacitors.pdf; componentlink2description: DigiKey Link; componentlink2url: https://www.digikey.com/en/products/detail/johanson-technology-inc/QLCD250Q470K1GV001T/1919286; Device Package: 0201 (0603 Metric); Features: High Q, Low Loss; lastupdated: 03/06/2024 19:34:07; Lifecycle Status: Active; Minimum Order: 1; Mounting Type: Surface Mount, MLCC; Operating Temperature: -55°C ~ 125°C; Package / Case: 0201 (0603 Metric); packaging: TapeAndReel; partid: 3708; Part Status: Active; price: 0.01; series: L; Size / Dimension: 0.024" L x 0.012" W (0.60mm x 0.30mm); Supplier 1: DigiKey; Supplier Part Number 1: 712-QLCD250Q470K1GV001TCT-ND; Thickness (Max): 0.013" (0.33mm); value: 47 pF; Voltage - Rated: 25V
  C553 C560: Part Number: QLCD250Q470K1GV001T
C544 C549 = GJM0335C1E4R7BB01D: CAP CER 4.7PF 25V C0G/NP0 0201; manufacturer: Murata Electronics; Temperature Coefficient: C0G, NP0; Tolerance: ±0.1pF; Applications: RF, Microwave, High Frequency; Capacitance: 4.7 pF; componentlink1description: Datasheet; componentlink1url: https://search.murata.co.jp/Ceramy/image/img/A01X/G101/ENG/GJM0335C1E4R7BB01-01.pdf; componentlink2description: DigiKey Link; componentlink2url: https://www.digikey.com/en/products/detail/murata-electronics/GJM0335C1E4R7BB01D/2592646; Device Package: 0201 (0603 Metric); Features: High Q, Low Loss; lastupdated: 03/06/2024 19:34:09; Lifecycle Status: Active; Minimum Order: 1; Mounting Type: Surface Mount; Operating Temperature: -55°C ~ 125°C; Package / Case: 0201 (0603 Metric); packaging: TapeAndReel; partid: 265; Part Status: Active; price: 0.01; series: GJM; Size / Dimension: 0.024" L x 0.012" W (0.60mm x 0.30mm); Supplier 1: DigiKey; Supplier Part Number 1: 490-8072-1-ND; Thickness (Max): 0.013" (0.33mm); value: 4.7 pF; Voltage - Rated: 25V
C545 C546 = GJM0335C1E6R8BB01D: CAP CER 6.8PF 25V C0G/NP0 0201; manufacturer: Murata Electronics; Temperature Coefficient: C0G, NP0; Tolerance: ±0.1pF; Applications: RF, Microwave, High Frequency; Capacitance: 6.8 pF; componentlink1description: Datasheet; componentlink1url: https://search.murata.co.jp/Ceramy/image/img/A01X/G101/ENG/GJM0335C1E6R8BB01-01.pdf; componentlink2description: DigiKey Link; componentlink2url: https://www.digikey.com/en/products/detail/murata-electronics/GJM0335C1E6R8BB01D/2592738; Device Package: 0201 (0603 Metric); Features: High Q, Low Loss; lastupdated: 03/06/2024 19:34:10; Lifecycle Status: Active; Minimum Order: 1; Mounting Type: Surface Mount; Operating Temperature: -55°C ~ 125°C; Package / Case: 0201 (0603 Metric); packaging: TapeAndReel; partid: 115; Part Status: Active; price: 0.01; series: GJM; Size / Dimension: 0.024" L x 0.012" W (0.60mm x 0.30mm); Supplier 1: DigiKey; Supplier Part Number 1: 490-11183-1-ND; Thickness (Max): 0.013" (0.33mm); value: 6.8 pF; Voltage - Rated: 25V
  C546: Part Number: GJM0335C1E6R8BB01D
C547 L504 = GJM0335C1E2R2BB01D: CAP CER 2.2PF 25V C0G/NP0 0201; manufacturer: Murata Electronics; Temperature Coefficient: C0G, NP0; Tolerance: ±0.1pF; Applications: RF, Microwave, High Frequency; Capacitance: 2.2 pF; componentlink1description: Datasheet; componentlink1url: https://search.murata.co.jp/Ceramy/image/img/A01X/G101/ENG/GJM0335C1E2R2BB01-01.pdf; componentlink2description: DigiKey Link; componentlink2url: https://www.digikey.com/en/products/detail/murata-electronics/GJM0335C1E2R2BB01D/2592553; Device Package: 0201 (0603 Metric); Features: High Q, Low Loss; lastupdated: 04/06/2024 19:01:06; Lifecycle Status: Active; Minimum Order: 1; Mounting Type: Surface Mount; Operating Temperature: -55°C ~ 125°C; Package / Case: 0201 (0603 Metric); packaging: TapeAndReel; partid: 1246; Part Status: Active; price: 0.01; series: GJM; Size / Dimension: 0.024" L x 0.012" W (0.60mm x 0.30mm); Supplier 1: DigiKey; Supplier Part Number 1: 490-8070-1-ND; Thickness (Max): 0.013" (0.33mm); Voltage - Rated: 25V
  C547: Part Number: GJM0335C1E2R2BB01D; Value: C?
  L504: Value: 2.2 pF
C548 = AF0201FR-0710KL: as R514 on sheet 5_3_frontend; Part Number: AF0201FR-0710KL; Value: 10 kOhms; ComponentLink1Description: Datasheet; ComponentLink1URL: https://www.yageo.com/upload/media/product/productsearch/datasheet/rchip/PYu-AF_51_RoHS_L_9.pdf; ComponentLink2Description: DigiKey Link; ComponentLink2URL: https://www.digikey.com/en/products/detail/yageo/AF0201FR-0710KL/5900138; Composition: Thick Film; Device Package: 0201 (0603 Metric); Features: Anti-Sulfur, Automotive AEC-Q200; Height - Seated (Max): 0.010" (0.26mm); LastUpdated: 04/06/2024 19:11:47; Lifecycle Status: Active; Minimum Order: 1; Number of Terminations: 2; Operating Temperature: -55°C ~ 125°C; Packaging: TapeAndReel; PartId: 78061; Part Status: Active; Price: 0.01; Ratings: AEC-Q200; Resistance: 10 kOhms; Series: AF; Size / Dimension: 0.024" L x 0.012" W (0.60mm x 0.30mm); Supplier 1: DigiKey; Supplier Part Number 1: 13-AF0201FR-0710KLCT-ND; Supplier Device Package: 0201; Tolerance: ±1%
C551 C555-C559 = C0402C104K4RECAUTO: as C537 on sheet 5_3_frontend; Part Number: C0402C104K4RECAUTO; Value: 0.1 µF; Applications: Automotive, ESD Protection; Capacitance: 0.1 µF; componentlink1description: Datasheet; componentlink1url: https://api.kemet.com/component-edge/download/datasheet/C0402C104K4RECAUTO.pdf; componentlink2description: DigiKey Link; componentlink2url: https://www.digikey.com/en/products/detail/kemet/C0402C104K4RECAUTO/8563695; Device Package: 0402 (1005 Metric); lastupdated: 09/02/2024 20:04:38; Lifecycle Status: Active; Minimum Order: 1; Mounting Type: Surface Mount, MLCC; Operating Temperature: -55°C ~ 125°C; Package / Case: 0402 (1005 Metric); packaging: TapeAndReel; partid: 1731; Part Status: Active; price: 0.01; Ratings: AEC-Q200; series: ESD SMD Auto X7R; Size / Dimension: 0.039" L x 0.020" W (1.00mm x 0.50mm); Supplier 1: DigiKey; Supplier Part Number 1: 399-17167-1-ND; Temperature Coefficient: X7R; Thickness (Max): 0.022" (0.55mm); Tolerance: ±10%; Voltage - Rated: 16V
C552 = GRM1555C1E103JE01J: as C535 on sheet 5_3_frontend; Value: 10000 pF; Applications: General Purpose; Capacitance: 10000 pF; componentlink1description: Datasheet; componentlink1url: https://search.murata.co.jp/Ceramy/image/img/A01X/G101/ENG/GRM1555C1E103JE01-01A.pdf; componentlink2description: DigiKey Link; componentlink2url: https://www.digikey.com/en/products/detail/murata-electronics/GRM1555C1E103JE01J/16033801; Device Package: 0402 (1005 Metric); lastupdated: 09/02/2024 20:04:09; Lifecycle Status: Active; Minimum Order: 1; Mounting Type: Surface Mount, MLCC; Operating Temperature: -55°C ~ 125°C; Package / Case: 0402 (1005 Metric); packaging: TapeAndReel; partid: 41084; Part Status: Active; price: 0.02; series: GRM; Size / Dimension: 0.039" L x 0.020" W (1.00mm x 0.50mm); Supplier 1: DigiKey; Supplier Part Number 1: 490-GRM1555C1E103JE01JCT-ND; Thickness (Max): 0.026" (0.65mm); Voltage - Rated: 25V
L505 = LQW15AN3N3D8ZD: FIXED IND 3.3NH 2A 0.03OHM SMD; Manufacturer: Murata Electronics; DC Resistance (DCR): 30mOhm Max; Frequency - Self Resonant: 14GHz; Inductance Frequency - Test: 100 MHz; Material - Core: Non-Magnetic; Q @ Freq: 30 @ 250MHz; Shielding: Unshielded; Tolerance: ±0.5nH; Type: Drum Core, Wirewound; ComponentLink1Description: Datasheet; ComponentLink1URL: https://search.murata.co.jp/Ceramy/image/img/P02/JELF243A-9138.pdf; ComponentLink2Description: DigiKey Link; ComponentLink2URL: https://www.digikey.com/en/products/detail/murata-electronics/LQW15AN3N3D8ZD/6798846; Current Rating (Amps): 2 A; Device Package: 0402 (1005 Metric); Height - Seated (Max): 0.024" (0.60mm); Inductance: 3.3 nH; LastUpdated: 03/06/2024 20:03:24; Lifecycle Status: Active; Minimum Order: 1; Mounting Type: Surface Mount; Operating Temperature: -55°C ~ 125°C; Package / Case: 0402 (1005 Metric); Packaging: TapeAndReel; PartId: 69; Part Status: Active; Price: 0.06; Ratings: AEC-Q200; Series: LQW15; Size / Dimension: 0.039" L x 0.024" W (1.00mm x 0.60mm); Supplier 1: DigiKey; Supplier Part Number 1: 490-15421-1-ND; Value: 3.3 nH
L506 = LQW15AN15NJ8ZD: FIXED IND 15NH 1.15A 0.114OHM SM; Manufacturer: Murata Electronics; DC Resistance (DCR): 114mOhm Max; Frequency - Self Resonant: 5.5GHz; Inductance Frequency - Test: 100 MHz; Material - Core: Non-Magnetic; Q @ Freq: 31 @ 250MHz; Shielding: Unshielded; Tolerance: ±5%; Type: Drum Core, Wirewound; ComponentLink1Description: Datasheet; ComponentLink1URL: https://search.murata.co.jp/Ceramy/image/img/P02/JELF243A-9138.pdf; ComponentLink2Description: DigiKey Link; ComponentLink2URL: https://www.digikey.com/en/products/detail/murata-electronics/LQW15AN15NJ8ZD/6798767; Current Rating (Amps): 1.15 A; Device Package: 0402 (1005 Metric); Height - Seated (Max): 0.024" (0.60mm); Inductance: 15 nH; LastUpdated: 03/06/2024 20:03:24; Lifecycle Status: Active; Minimum Order: 1; Mounting Type: Surface Mount; Operating Temperature: -55°C ~ 125°C; Package / Case: 0402 (1005 Metric); Packaging: TapeAndReel; PartId: 108; Part Status: Active; Price: 0.06; Ratings: AEC-Q200; Series: LQW15; Size / Dimension: 0.039" L x 0.024" W (1.00mm x 0.60mm); Supplier 1: DigiKey; Supplier Part Number 1: 490-15342-1-ND; Supplier Device Package: 0402 (1005 Metric); Value: 15 nH
L507 = LQW15AN18NG8ZD: FIXED IND 18NH 1.05A 0.13OHM SMD; Manufacturer: Murata Electronics; DC Resistance (DCR): 130mOhm Max; Frequency - Self Resonant: 5.2GHz; Inductance Frequency - Test: 100 MHz; Material - Core: Non-Magnetic; Q @ Freq: 30 @ 250MHz; Shielding: Unshielded; Tolerance: ±2%; Type: Drum Core, Wirewound; ComponentLink1Description: Datasheet; ComponentLink1URL: https://search.murata.co.jp/Ceramy/image/img/P02/JELF243A-9138.pdf; ComponentLink2Description: DigiKey Link; ComponentLink2URL: https://www.digikey.com/en/products/detail/murata-electronics/LQW15AN18NG8ZD/6798772; Current Rating (Amps): 1.05 A; Device Package: 0402 (1005 Metric); Height - Seated (Max): 0.024" (0.60mm); Inductance: 18 nH; LastUpdated: 03/06/2024 20:03:23; Lifecycle Status: Active; Minimum Order: 1; Mounting Type: Surface Mount; Operating Temperature: -55°C ~ 125°C; Package / Case: 0402 (1005 Metric); Packaging: TapeAndReel; PartId: 193; Part Status: Active; Price: 0.07; Ratings: AEC-Q200; Series: LQW15; Size / Dimension: 0.039" L x 0.024" W (1.00mm x 0.60mm); Supplier 1: DigiKey; Supplier Part Number 1: 490-15347-1-ND; Supplier Device Package: 0402 (1005 Metric); Value: 18 nH
U509 = SX1276IMLTRT: 137 MHz to 1020 MHz Low Power Long Range Transceiver
C561 = FT2MNTUM-32.0-T1: Part Number: FT2MNTUM-32.0-T1